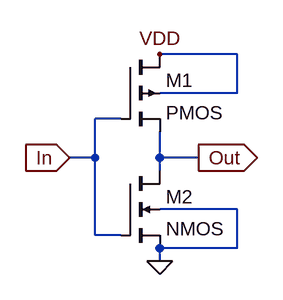
[diagram p0: schematic inverter.asc]
inverter.asc, the LTspice schematic file:
Version 4
SHEET 1 880 680
WIRE 320 80 224 80
WIRE 320 128 320 80
WIRE 320 128 224 128
WIRE 176 160 144 160
WIRE 144 208 144 160
WIRE 144 208 112 208
WIRE 224 208 224 176
WIRE 272 208 224 208
WIRE 224 224 224 208
WIRE 320 272 224 272
WIRE 144 304 144 208
WIRE 176 304 144 304
WIRE 320 320 320 272
WIRE 320 320 224 320
WIRE 224 336 224 320
FLAG 112 208 In
IOPIN 112 208 In
FLAG 272 208 Out
IOPIN 272 208 Out
FLAG 224 80 VDD
FLAG 224 336 0
SYMBOL pmos4 176 80 R0
SYMATTR InstName M1
SYMBOL nmos4 176 224 R0
SYMATTR InstName M2

The netlist it stands for:
* inverter.asc
M1 VDD In Out VDD PMOS
M2 Out In 0 0 NMOS
.model NMOS NMOS
.model PMOS PMOS
.lib standard.mos
.backanno
.end